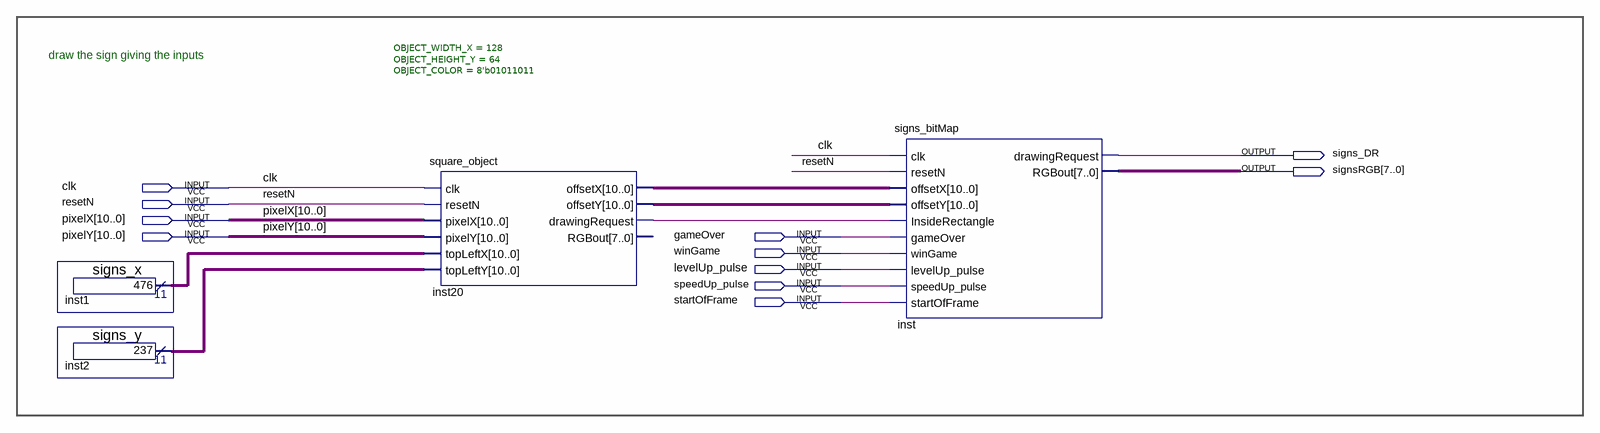
[diagram p0: schematic sheet]
// Quartus schematic SIGNS_DISPLAY.bdf as structural Verilog: 4 symbols, 11 pins
module SIGNS_DISPLAY (
  input  clk,
  input  resetN,
  input  [10:0] pixelX,
  input  [10:0] pixelY,
  input  gameOver,
  input  winGame,
  input  levelUp_pulse,
  input  speedUp_pulse,
  input  startOfFrame,
  output signs_DR,
  output [7:0] signsRGB
);

  wire inst20_drawingrequest;
  wire [10:0] inst1_result, inst2_result, inst20_offsetx, inst20_offsety;

  signs_x inst1 (.result(inst1_result));
  signs_y inst2 (.result(inst2_result));
  square_object #(.OBJECT_WIDTH_X(128), .OBJECT_HEIGHT_Y(64), .OBJECT_COLOR(8'b01011011)) inst20 (
    .clk(clk), .resetN(resetN), .pixelX(pixelX), .pixelY(pixelY), .topLeftX(inst1_result),
    .topLeftY(inst2_result), .offsetX(inst20_offsetx), .offsetY(inst20_offsety),
    .drawingRequest(inst20_drawingrequest));  // open: RGBout
  signs_bitMap inst (
    .clk(clk), .resetN(resetN), .offsetX(inst20_offsetx), .offsetY(inst20_offsety),
    .InsideRectangle(inst20_drawingrequest), .gameOver(gameOver), .winGame(winGame),
    .levelUp_pulse(levelUp_pulse), .speedUp_pulse(speedUp_pulse), .startOfFrame(startOfFrame),
    .drawingRequest(signs_DR), .RGBout(signsRGB));

  // Notes on the sheet:
  //   draw the sign giving the inputs
endmodule
